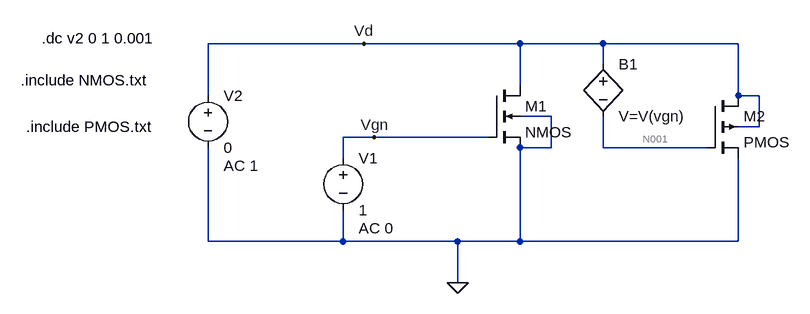
[diagram p0: schematic CMOS_Char_dc.asc]
CMOS_Char_dc.asc, the LTspice schematic file:
Version 4
SHEET 1 880 680
WIRE -80 64 -320 64
WIRE 160 64 -80 64
WIRE 288 64 160 64
WIRE 496 64 288 64
WIRE 288 96 288 64
WIRE 160 128 160 64
WIRE -320 144 -320 64
WIRE 496 144 496 64
WIRE 528 144 496 144
WIRE 208 176 160 176
WIRE 528 192 528 144
WIRE 528 192 496 192
WIRE -64 208 -112 208
WIRE 112 208 -64 208
WIRE 208 224 208 176
WIRE 208 224 160 224
WIRE 288 224 288 176
WIRE 448 224 288 224
WIRE -112 240 -112 208
WIRE -320 368 -320 224
WIRE -112 368 -112 320
WIRE -112 368 -320 368
WIRE 64 368 -112 368
WIRE 160 368 160 224
WIRE 160 368 64 368
WIRE 496 368 496 240
WIRE 496 368 160 368
WIRE 64 432 64 368
FLAG -64 208 Vgn
FLAG -80 64 Vd
FLAG 64 432 0
SYMBOL voltage -112 224 R0
WINDOW 123 24 124 Left 2
WINDOW 39 0 0 Left 0
SYMATTR Value2 AC 0
SYMATTR InstName V1
SYMATTR Value 1
SYMBOL voltage -320 128 R0
WINDOW 123 24 124 Left 2
WINDOW 39 0 0 Left 0
SYMATTR Value2 AC 1
SYMATTR InstName V2
SYMATTR Value 0
SYMBOL nmos4 112 128 R0
SYMATTR InstName M1
SYMATTR Value2 w=100u
SYMBOL pmos4 448 144 R0
SYMATTR InstName M2
SYMATTR Value2 w=100u
SYMBOL bv 288 80 R0
SYMATTR InstName B1
SYMATTR Value V=V(vgn)
TEXT -608 120 Left 2 !.include NMOS.txt
TEXT -576 56 Left 2 !.dc v2 0 1 0.001
TEXT -600 192 Left 2 !.include PMOS.txt

The netlist it stands for:
* CMOS_Char_dc.asc
V1 Vgn 0 1 AC 0
V2 Vd 0 0 AC 1
M1 Vd Vgn 0 0 NMOS w=100u
M2 Vd N001 0 Vd PMOS w=100u
B1 Vd N001 V=V(vgn)
.model NMOS NMOS
.model PMOS PMOS
.lib standard.mos
.include NMOS.txt
.dc v2 0 1 0.001
.include PMOS.txt
.backanno
.end

* Results of the author's LTspice run, read from the files saved beside the schematic
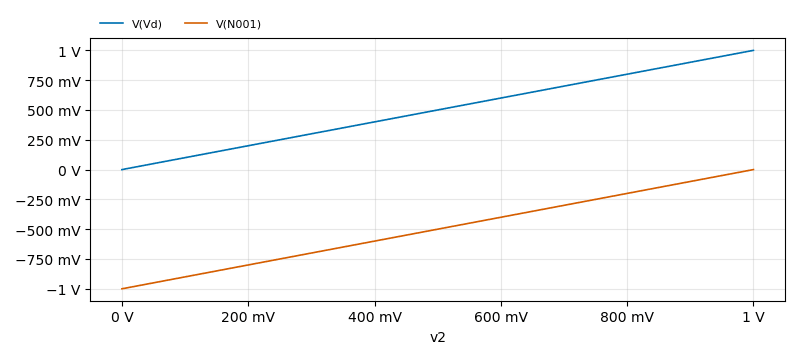
[diagram p1: DC transfer characteristic of CMOS_Char_dc.asc, plotted from the saved traces]
* DC transfer characteristic, 1 run:
*   V(Vd): 0 V at v2=0 V, 1 V at v2=1 V, min 0 V, max 1 V
*   V(N001): -1 V at v2=0 V, 0 V at v2=1 V, min -1 V, max 0 V